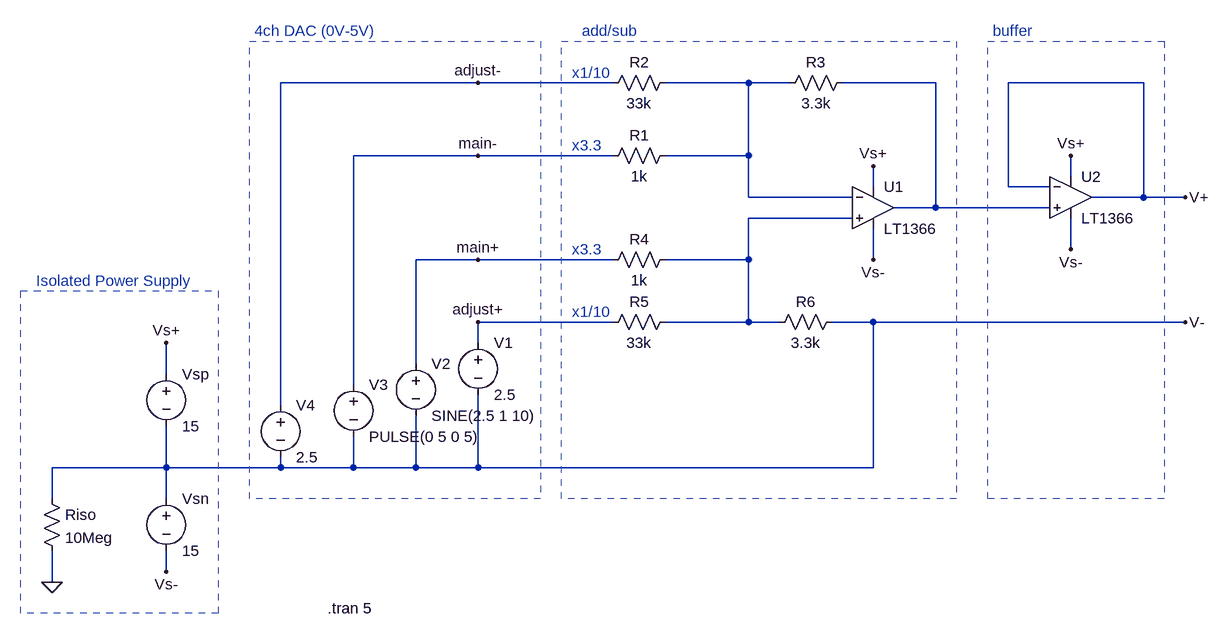
[diagram p0: schematic amp.asc]
amp.asc, the LTspice schematic file:
Version 4
SHEET 1 1540 824
WIRE 144 -64 -160 -64
WIRE 352 -64 144 -64
WIRE 560 -64 432 -64
WIRE 624 -64 560 -64
WIRE 848 -64 704 -64
WIRE 1168 -64 960 -64
WIRE 144 48 -48 48
WIRE 352 48 144 48
WIRE 560 48 560 -64
WIRE 560 48 432 48
WIRE 1056 80 1056 48
WIRE 752 96 752 64
WIRE 960 96 960 -64
WIRE 1024 96 960 96
WIRE 560 112 560 48
WIRE 720 112 560 112
WIRE 1168 112 1168 -64
WIRE 1168 112 1088 112
WIRE 1232 112 1168 112
WIRE 848 128 848 -64
WIRE 848 128 784 128
WIRE 1024 128 848 128
WIRE 720 144 560 144
WIRE 1056 192 1056 144
WIRE 144 208 48 208
WIRE 352 208 144 208
WIRE 560 208 560 144
WIRE 560 208 432 208
WIRE 752 208 752 160
WIRE 352 304 144 304
WIRE 560 304 560 208
WIRE 560 304 432 304
WIRE 608 304 560 304
WIRE 752 304 688 304
WIRE 1232 304 752 304
WIRE 144 336 144 304
WIRE 48 368 48 208
WIRE -336 384 -336 336
WIRE -48 400 -48 48
WIRE -160 432 -160 -64
WIRE -336 528 -336 464
WIRE -336 528 -512 528
WIRE -160 528 -160 512
WIRE -160 528 -336 528
WIRE -48 528 -48 480
WIRE -48 528 -160 528
WIRE 48 528 48 448
WIRE 48 528 -48 528
WIRE 144 528 144 416
WIRE 144 528 48 528
WIRE 752 528 752 304
WIRE 752 528 144 528
WIRE -512 576 -512 528
WIRE -336 576 -336 528
WIRE -336 688 -336 656
WIRE -512 704 -512 656
FLAG -512 704 0
FLAG 1232 112 V+
FLAG 1232 304 V-
FLAG -336 336 Vs+
FLAG -336 688 Vs-
FLAG 752 64 Vs+
FLAG 752 208 Vs-
FLAG 1056 48 Vs+
FLAG 1056 192 Vs-
FLAG 144 48 main-
FLAG 144 208 main+
FLAG 144 304 adjust+
FLAG 144 -64 adjust-
SYMBOL voltage -336 368 R0
WINDOW 123 0 0 Left 0
WINDOW 39 0 0 Left 0
SYMATTR InstName Vsp
SYMATTR Value 15
SYMBOL Opamps\\LT1366 752 64 R0
SYMATTR InstName U1
SYMBOL voltage -336 560 R0
WINDOW 123 0 0 Left 0
WINDOW 39 0 0 Left 0
SYMATTR InstName Vsn
SYMATTR Value 15
SYMBOL voltage 144 320 R0
WINDOW 123 0 0 Left 0
WINDOW 39 0 0 Left 0
SYMATTR InstName V1
SYMATTR Value 2.5
SYMBOL res -528 560 R0
SYMATTR InstName Riso
SYMATTR Value 10Meg
SYMBOL res 448 32 R90
WINDOW 0 0 56 VBottom 2
WINDOW 3 32 56 VTop 2
SYMATTR InstName R1
SYMATTR Value 1k
SYMBOL res 448 -80 R90
WINDOW 0 0 56 VBottom 2
WINDOW 3 32 56 VTop 2
SYMATTR InstName R2
SYMATTR Value 33k
SYMBOL res 720 -80 R90
WINDOW 0 0 56 VBottom 2
WINDOW 3 32 56 VTop 2
SYMATTR InstName R3
SYMATTR Value 3.3k
SYMBOL res 448 192 R90
WINDOW 0 0 56 VBottom 2
WINDOW 3 32 56 VTop 2
SYMATTR InstName R4
SYMATTR Value 1k
SYMBOL res 448 288 R90
WINDOW 0 0 56 VBottom 2
WINDOW 3 32 56 VTop 2
SYMATTR InstName R5
SYMATTR Value 33k
SYMBOL res 704 288 R90
WINDOW 0 0 56 VBottom 2
WINDOW 3 32 56 VTop 2
SYMATTR InstName R6
SYMATTR Value 3.3k
SYMBOL voltage 48 352 R0
WINDOW 123 0 0 Left 0
WINDOW 39 0 0 Left 0
SYMATTR InstName V2
SYMATTR Value SINE(2.5 1 10)
SYMBOL voltage -48 384 R0
WINDOW 123 0 0 Left 0
WINDOW 39 0 0 Left 0
SYMATTR InstName V3
SYMATTR Value PULSE(0 5 0 5)
SYMBOL Opamps\\LT1366 1056 48 R0
SYMATTR InstName U2
SYMBOL voltage -160 416 R0
WINDOW 123 0 0 Left 0
WINDOW 39 0 0 Left 0
SYMATTR InstName V4
SYMATTR Value 2.5
TEXT -88 744 Left 2 !.tran 5
TEXT 288 -80 Left 2 ;x1/10
TEXT 288 32 Left 2 ;x3.3
TEXT -536 240 Left 2 ;Isolated Power Supply
TEXT -200 -144 Left 2 ;4ch DAC (0V-5V)
TEXT 288 192 Left 2 ;x3.3
TEXT 288 288 Left 2 ;x1/10
TEXT 304 -144 Left 2 ;add/sub
TEXT 936 -144 Left 2 ;buffer
RECTANGLE Normal -256 752 -560 256 2
RECTANGLE Normal 240 576 -208 -128 2
RECTANGLE Normal 880 576 272 -128 2
RECTANGLE Normal 1200 576 928 -128 2

The netlist it stands for:
* amp.asc
Vsp Vs+ V- 15
XU1 N003 N001 Vs+ Vs- N002 LT1366  ; pins In+ In- V+ V- OUT
Vsn V- Vs- 15
V1 adjust+ V- 2.5
Riso V- 0 10Meg
R1 N001 main- 1k
R2 N001 adjust- 33k
R3 N002 N001 3.3k
R4 N003 main+ 1k
R5 N003 adjust+ 33k
R6 V- N003 3.3k
V2 main+ V- SINE(2.5 1 10)
V3 main- V- PULSE(0 5 0 5)
XU2 N002 V+ Vs+ Vs- V+ LT1366  ; pins In+ In- V+ V- OUT
V4 adjust- V- 2.5
.tran 5
* x1/10
* x3.3
* Isolated Power Supply
* 4ch DAC (0V-5V)
* x3.3
* x1/10
* add/sub
* buffer
.lib LTC.lib
.backanno
.end